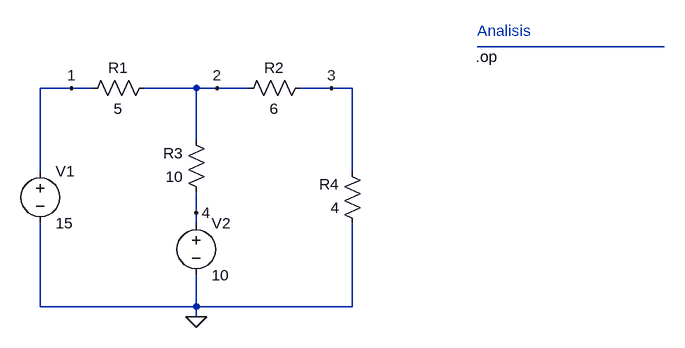
[diagram p0: schematic ejemplo1_corrientes_mallas.asc]
ejemplo1_corrientes_mallas.asc, the LTspice schematic file:
Version 4
SHEET 1 880 680
WIRE 672 48 384 48
WIRE -240 112 -288 112
WIRE -208 112 -240 112
WIRE -48 112 -128 112
WIRE -16 112 -48 112
WIRE 32 112 -16 112
WIRE 160 112 112 112
WIRE 192 112 160 112
WIRE -48 192 -48 112
WIRE -288 240 -288 112
WIRE 192 240 192 112
WIRE -48 304 -48 272
WIRE -48 320 -48 304
WIRE -288 448 -288 320
WIRE -48 448 -48 400
WIRE -48 448 -288 448
WIRE 192 448 192 320
WIRE 192 448 -48 448
WIRE -48 464 -48 448
FLAG -48 464 0
FLAG -240 112 1
FLAG 160 112 3
FLAG -16 112 2
FLAG -48 304 4
SYMBOL res -112 96 R90
WINDOW 0 0 56 VBottom 2
WINDOW 3 32 56 VTop 2
SYMATTR InstName R1
SYMATTR Value 5
SYMBOL res 128 96 R90
WINDOW 0 0 56 VBottom 2
WINDOW 3 32 56 VTop 2
SYMATTR InstName R2
SYMATTR Value 6
SYMBOL res -32 288 R180
WINDOW 0 36 76 Left 2
WINDOW 3 36 40 Left 2
SYMATTR InstName R3
SYMATTR Value 10
SYMBOL voltage -288 224 R0
SYMATTR InstName V1
SYMATTR Value 15
SYMBOL res 208 336 R180
WINDOW 0 36 76 Left 2
WINDOW 3 36 40 Left 2
SYMATTR InstName R4
SYMATTR Value 4
SYMBOL voltage -48 304 R0
SYMATTR InstName V2
SYMATTR Value 10
TEXT 382 64 Left 2 !.op
TEXT 384 24 Left 2 ;Analisis

The netlist it stands for:
* ejemplo1_corrientes_mallas.asc
R1 2 1 5
R2 3 2 6
R3 4 2 10
V1 1 0 15
R4 0 3 4
V2 4 0 10
.op
* Analisis
.backanno
.end